# EAGLE schematic Counter_60sec_THT (EAGLE 9.6.2)

## Sheet 1 of 2
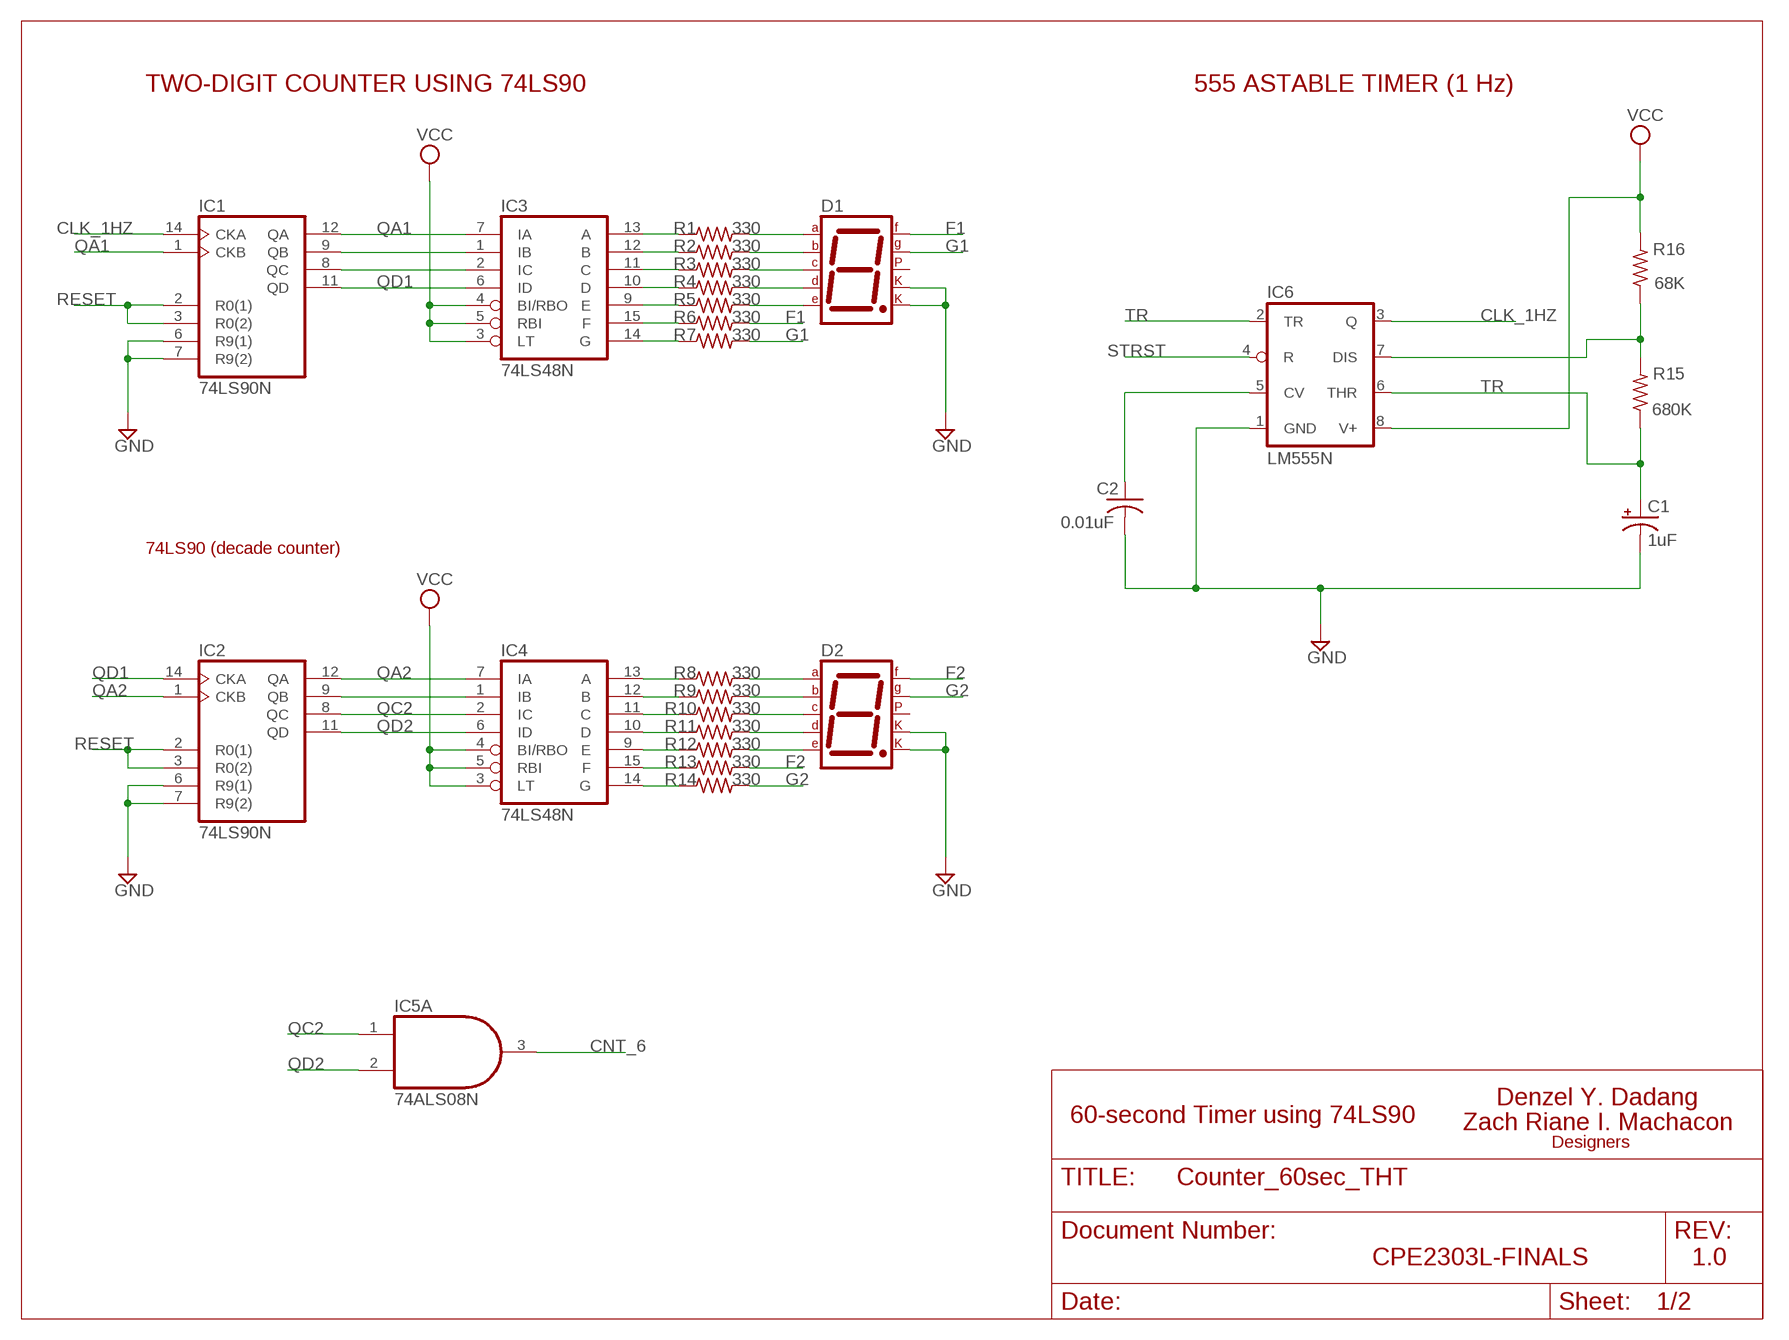
[diagram p0: schematic, sheet 1]

### Parts
C1  1uF  CPOL-USE1.8-4  [E1,8-4]
C2  0.01uF  C-US025-025X050  [C025-025X050]
D1  7SEG-CK  [7SEG-13]
D2  7SEG-CK  [7SEG-13]
IC1  74LS90N  [DIL14]
IC2  74LS90N  [DIL14]
IC3  74LS48N  [DIL16]
IC4  74LS48N  [DIL16]
IC5  74ALS08N  [DIL14]
IC6  LM555N  [DIL08]
R1  330  R-US_0204/7  [0204/7]
R2  330  R-US_0204/7  [0204/7]
R3  330  R-US_0204/7  [0204/7]
R4  330  R-US_0204/7  [0204/7]
R5  330  R-US_0204/7  [0204/7]
R6  330  R-US_0204/7  [0204/7]
R7  330  R-US_0204/7  [0204/7]
R8  330  R-US_0204/7  [0204/7]
R9  330  R-US_0204/7  [0204/7]
R10  330  R-US_0204/7  [0204/7]
R11  330  R-US_0204/7  [0204/7]
R12  330  R-US_0204/7  [0204/7]
R13  330  R-US_0204/7  [0204/7]
R14  330  R-US_0204/7  [0204/7]
R15  680K  R-US_0204/7  [0204/7]
R16  68K  R-US_0204/7  [0204/7]

### Nets
CLK_1HZ: IC1.14(CKA) IC6.3(Q)
CNT_6: IC5.3(A:O) ; also sheet 2
F1: D1.9(F) R6.2
F2: D2.9(F) R13.2
G1: D1.10(G) R7.2
G2: D2.10(G) R14.2
GND: C1.- C2.2 D1.3(CK1) D1.8(CK2) D2.3(CK1) D2.8(CK2) IC1.6(R9(1)) IC1.7(R9(2)) IC2.6(R9(1)) IC2.7(R9(2)) IC6.1(GND) ; also sheet 2
N$6: IC3.13(A) R1.1
N$7: IC6.7(DIS) R15.2 R16.1
N$8: IC1.9(QB) IC3.1(IB)
N$9: C2.1 IC6.5(CV)
N$10: IC1.8(QC) IC3.2(IC)
N$11: IC3.12(B) R2.1
N$12: IC3.11(C) R3.1
N$13: IC3.10(D) R4.1
N$14: IC3.9(E) R5.1
N$15: IC3.15(F) R6.1
N$16: IC3.14(G) R7.1
N$17: IC4.13(A) R8.1
N$18: IC2.9(QB) IC4.1(IB)
N$19: D1.1(E) R5.2
N$20: D1.2(D) R4.2
N$21: D1.4(C) R3.2
N$22: D1.6(B) R2.2
N$23: D1.7(A) R1.2
N$24: IC4.12(B) R9.1
N$25: IC4.11(C) R10.1
N$26: IC4.10(D) R11.1
N$27: IC4.9(E) R12.1
N$28: IC4.15(F) R13.1
N$29: IC4.14(G) R14.1
N$30: D2.7(A) R8.2
N$31: D2.6(B) R9.2
N$32: D2.4(C) R10.2
N$33: D2.2(D) R11.2
N$34: D2.1(E) R12.2
QA1: IC1.1(CKB) IC1.12(QA) IC3.7(IA)
QA2: IC2.1(CKB) IC2.12(QA) IC4.7(IA)
QC2: IC2.8(QC) IC4.2(IC) IC5.1(A:I0)
QD1: IC1.11(QD) IC2.14(CKA) IC3.6(ID)
QD2: IC2.11(QD) IC4.6(ID) IC5.2(A:I1)
RESET: IC1.2(R0(1)) IC1.3(R0(2)) IC2.2(R0(1)) IC2.3(R0(2)) ; also sheet 2
STRST: IC6.4(R) ; also sheet 2
TR: C1.+ IC6.2(TR) IC6.6(THR) R15.1
VCC: IC3.3(LT) IC3.4(BI/RBO) IC3.5(RBI) IC4.3(LT) IC4.4(BI/RBO) IC4.5(RBI) IC6.8(V+) R16.2 ; also sheet 2
Unconnected: D1.5(DP) D2.5(DP) IC5.4(B:I0) IC5.5(B:I1) IC5.6(B:O) IC5.8(C:O) IC5.9(C:I0) IC5.10(C:I1) IC5.11(D:O) IC5.12(D:I0) IC5.13(D:I1)

### Notes on the sheet
- TWO-DIGIT COUNTER USING 74LS90 | 555 ASTABLE TIMER (1 Hz)
- 74LS90 (decade counter)
- Denzel Y. Dadang
- 60-second Timer using 74LS90
- Zach Riane I. Machacon
- Designers
- CPE2303L-FINALS | 1.0

## Sheet 2 of 2
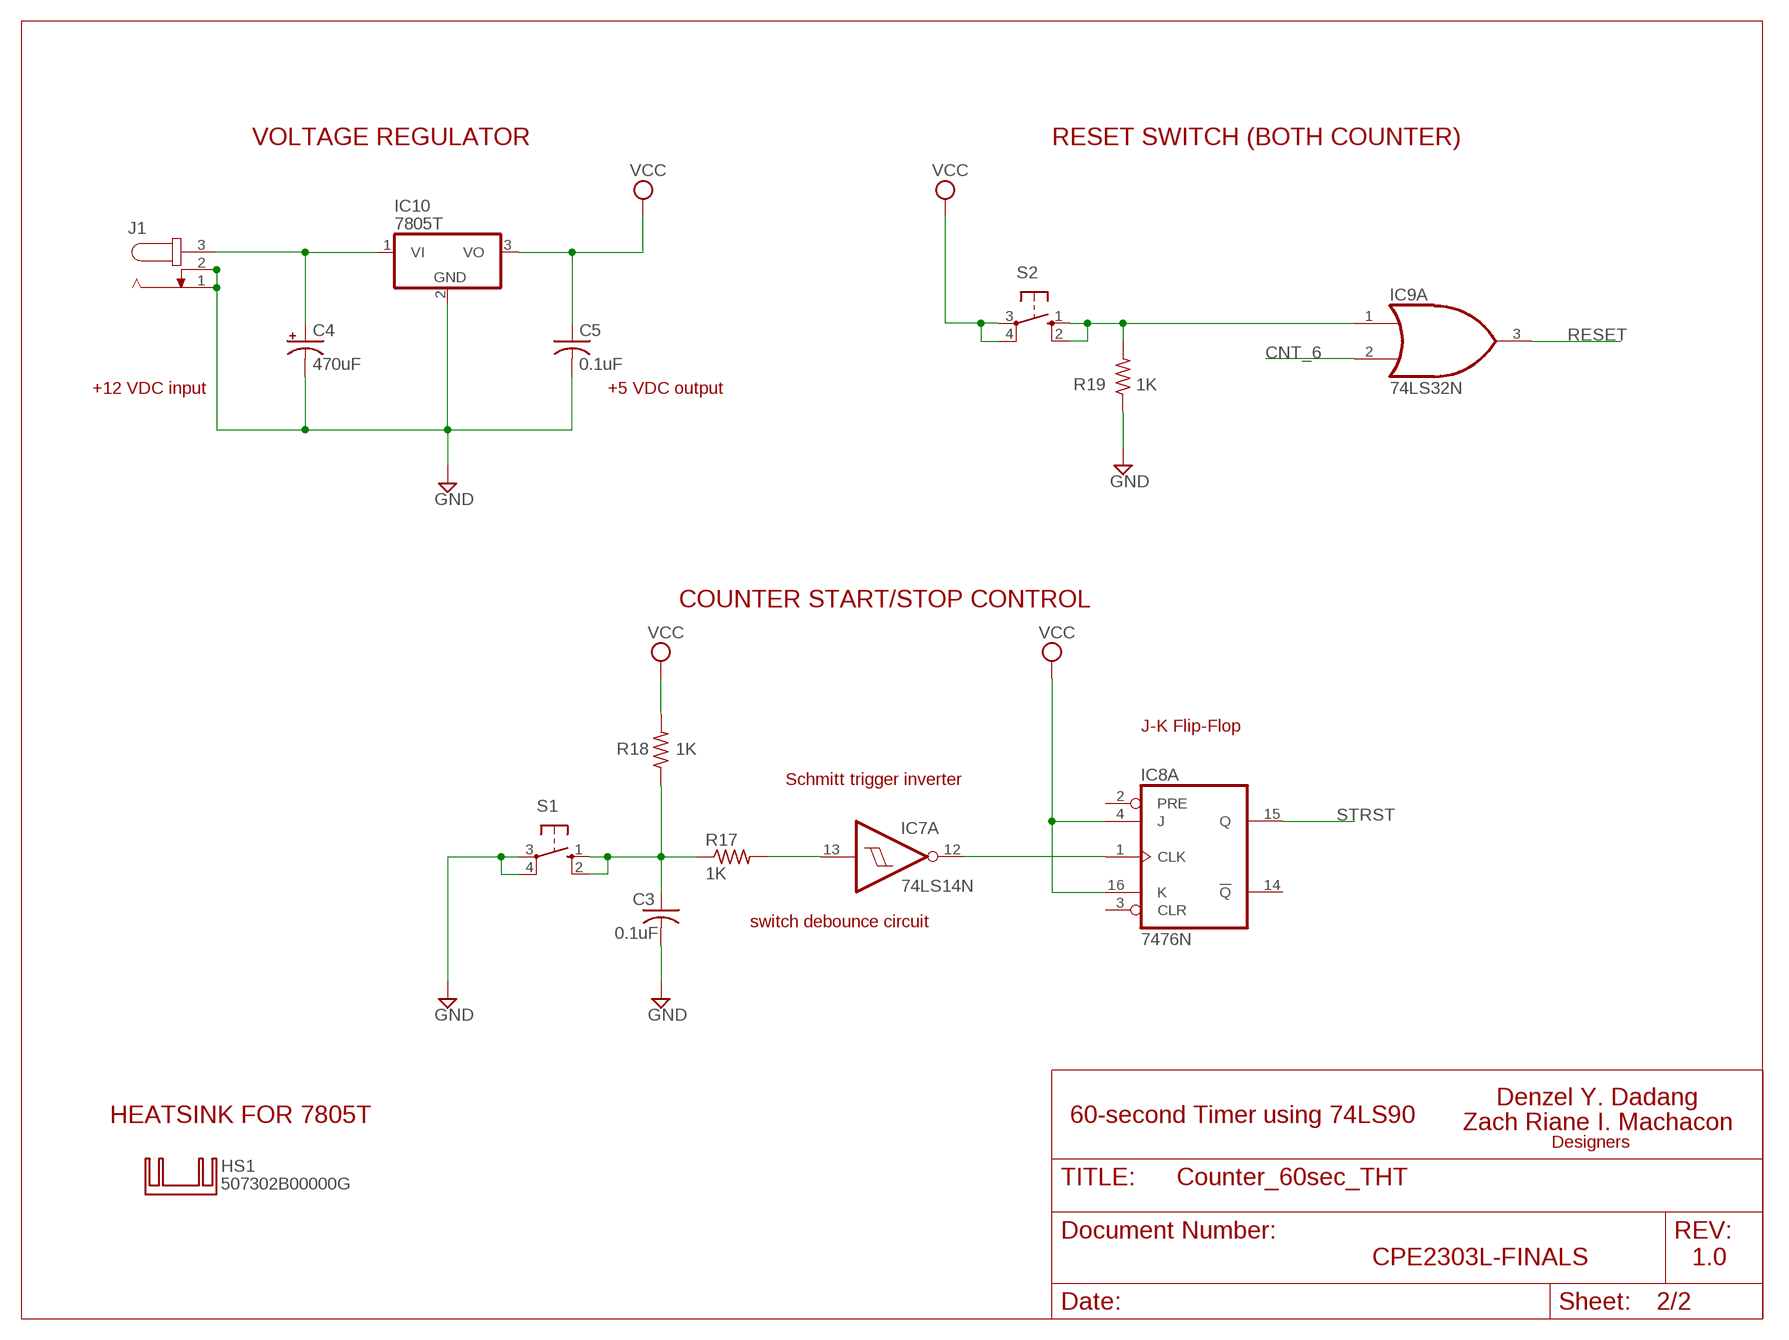
[diagram p1: schematic, sheet 2]

### Parts
C3  0.1uF  C-US025-025X050  [C025-025X050]
C4  470uF  CPOL-USE1.8-4  [E1,8-4]
C5  0.1uF  C-US025-025X050  [C025-025X050]
HS1  507302B00000G  [TO-220H]
IC7  74LS14N  [DIL14]
IC8  7476N  [DIL16]
IC9  74LS32N  [DIL14]
IC10  7805T  [TO220H]
J1  JACK-PLUG1  [SPC4078]
R17  1K  R-US_0204/7  [0204/7]
R18  1K  R-US_0204/7  [0204/7]
R19  1K  R-US_0204/7  [0204/7]
S1  10-XX  [B3F-10XX]
S2  10-XX  [B3F-10XX]

### Nets
CNT_6: IC9.2(A:I1) ; also sheet 1
GND: C3.2 C4.- C5.2 IC10.2(GND) J1.1 J1.2 R19.1 S1.3(P) S1.4(P1) ; also sheet 1
N$1: C4.+ IC10.1(VI) J1.3
N$2: IC7.12(A:O) IC8.1(A:CLK)
N$3: IC7.13(A:I) R17.2
N$4: C3.1 R17.1 R18.1 S1.1(S) S1.2(S1)
N$5: IC9.1(A:I0) R19.2 S2.1(S) S2.2(S1)
RESET: IC9.3(A:O) ; also sheet 1
STRST: IC8.15(A:Q) ; also sheet 1
VCC: C5.1 IC8.4(A:J) IC8.16(A:K) IC10.3(VO) R18.2 S2.3(P) S2.4(P1) ; also sheet 1
Unconnected: IC7.1(D:I) IC7.2(D:O) IC7.3(E:I) IC7.4(E:O) IC7.5(F:I) IC7.6(F:O) IC7.8(C:O) IC7.9(C:I) IC7.10(B:O) IC7.11(B:I) IC8.2(A:PRE) IC8.3(A:CLR) IC8.6(B:CLK) IC8.7(B:PRE) IC8.8(B:CLR) IC8.9(B:J) IC8.10(B:!Q) IC8.11(B:Q) IC8.12(B:K) IC8.14(A:!Q) IC9.4(B:I0) IC9.5(B:I1) IC9.6(B:O) IC9.8(C:O) IC9.9(C:I0) IC9.10(C:I1) IC9.11(D:O) IC9.12(D:I0) IC9.13(D:I1)

### Notes on the sheet
- VOLTAGE REGULATOR | RESET SWITCH (BOTH COUNTER)
- +12 VDC input | +5 VDC output
- COUNTER START/STOP CONTROL
- J-K Flip-Flop
- Schmitt trigger inverter
- switch debounce circuit
- Denzel Y. Dadang
- HEATSINK FOR 7805T | 60-second Timer using 74LS90
- Zach Riane I. Machacon
- Designers
- CPE2303L-FINALS | 1.0

## Power pins joined to a net without a drawn wire
GND: IC1.10(GND) IC2.10(GND) IC3.8(GND) IC4.8(GND) IC5.7(P:GND) IC7.7(P:GND) IC8.13(P:GND) IC9.7(P:GND)
VCC: IC1.5(VCC) IC2.5(VCC) IC3.16(VCC) IC4.16(VCC) IC5.14(P:VCC) IC7.14(P:VCC) IC8.5(P:VCC) IC9.14(P:VCC)

## Library data of the parts
C1 C4 = rcl:CPOL-US: POLARIZED CAPACITOR, American symbol; SPICEPREFIX: C
C2 C3 C5 = rcl:C-US: CAPACITOR, American symbol; SPICEPREFIX: C
D1 D2 = special:7SEG-CK: 7-segment DISPLAY single cathode, 13 mm
HS1 = to220-heatsink:507302B00000G
IC1 IC2 = 74xx-us:74*90: Decade, divide by twelve and binary COUNTER
IC3 IC4 = 74xx-us:74*48: BCD to seven segment DECODER/DRIVER
IC5 = 74xx-us:74*08: Quad 2-input AND gate
IC6 = linear:*555: TIMER
IC7 = 74xx-us:74*14: Hex schmitt trigger INVERTER
IC8 = 74xx-us:74*76: Dual J-K FLIP FLOP, preset and clear
IC9 = 74xx-us:74*32: Quad 2-input OR gate
IC10 = linear:78*: Positive VOLTAGE REGULATOR Source: http://cache.national.com/ds/LM/LM78L05.pdf http://www.fairchildsemi.com/ds/LM/LM7805.pdf
J1 = con-jack:JACK-PLUG: DC POWER JACK Power Jack, DC, Right Angle, Through Hole, Rated 5A at 16VDC, PC Terminals Distributor: Farnell (www.Farnell.de) Drawing: 84N1161.pdf / 84N1162.pdf Manufacturer: SPC Technology (www.spctechnology.com) Type: SPC4077 / SPC 4078; OC_FARNELL: unknown; OC_NEWARK: unknown
R1-R19 = rcl:R-US_: RESISTOR, American symbol; SPICEPREFIX: R
S1 S2 = switch-omron:10-XX: OMRON SWITCH; MPN: B3F-1000; OC_FARNELL: 176432; OC_NEWARK: 36M3542